# Altium schematic sheet ETHERNET.SchDoc
size A4; SheetNumber: 8; SheetTotal: 9
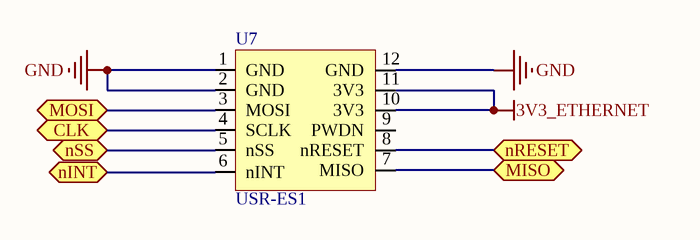
[diagram p0: ETHERNET.SchDoc]

## Parts
U7  USR-ES1  [USR-ES1]

## Ports
CLK (bidir), MISO (bidir), MOSI (bidir), nINT (bidir), nRESET (bidir), nSS (bidir)

## Nets
3V3_ETHERNET: U7.10(3V3) U7.11(3V3)
GND: U7.1(GND) U7.2(GND) U7.12(GND)
CLK: U7.4(SCLK) ; port CLK
MISO: U7.7(MISO) ; port MISO
MOSI: U7.3(MOSI) ; port MOSI
nINT: U7.6(nINT) ; port nINT
nRESET: U7.8(nRESET) ; port nRESET
nSS: U7.5(nSS) ; port nSS

Not connected (* = marked no-connect by the designer): U7 9(PWDN)

## Library data of the parts
U7 = USR-ES1: Ethernet module